# EAGLE schematic solar_mains_charge_manager (EAGLE 8.4.1)
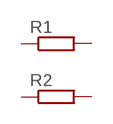
[diagram p0: schematic, sheet 1]

## Parts
R1  R-EU_0204/5  [0204/5]
R2  R-EU_0204/5  [0204/5]
Unconnected: R1.1 R1.2 R2.1 R2.2

## Library data of the parts
R1 R2 = resistor:R-EU_: RESISTOR, European symbol